# Altium project Controller.PrjPcb
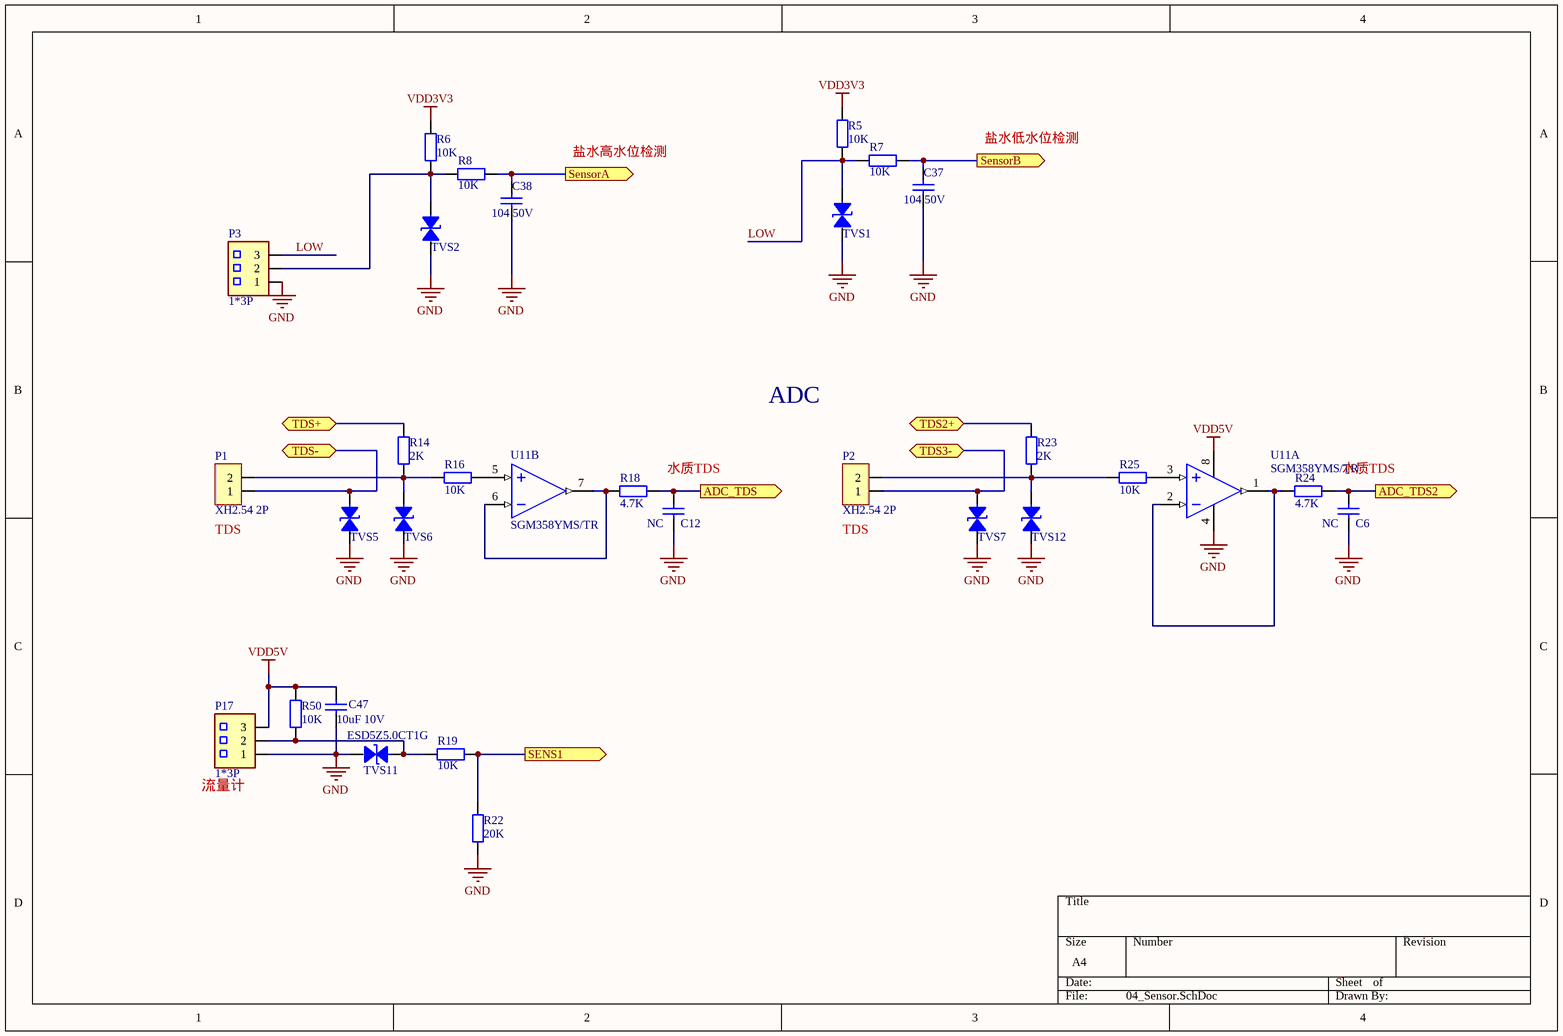
[diagram p0: 04_Sensor.SchDoc]
7 sheets, 201 parts. Net scope: global (net labels, ports and power ports of the same name join across sheets).
Board file: 电解模块主控板_V1.1_ZM_20211015.PcbDoc
Sheets:
  04_Sensor.SchDoc
  05_USART.SchDoc
  08_Peripherals.SchDoc
  13_SPI_Flash.SchDoc
  02_Power.SchDoc
  com.SchDoc
  07_EL_CON.SchDoc

## Sheet 04_Sensor.SchDoc
size A4

### Parts
C6  NC  [0603C]
C12  NC  [SMD-0603C]
C37  104 50V  [SMD-0603C]
C38  104 50V  [SMD-0603C]
C47  10uF 10V  [SMD-0603C]
P1  XH2.54 2P  [SIP-2A]
P2  XH2.54 2P  [SIP-2A]
P3  1*3P  [3X2MMZ]
P17  1*3P  [3X2.54MMZ2]
R5  10K  [SMD-0603]
R6  10K  [SMD-0603]
R7  10K  [SMD-0603]
R8  10K  [SMD-0603]
R14  2K  [SMD-0603]
R16  10K  [SMD-0603]
R18  4.7K  [SMD-0603]
R19  10K  [SMD-0603]
R22  20K  [SMD-0603]
R23  2K  [0603R]
R24  4.7K  [0603R]
R25  10K  [SMD-0603]
R50  10K  [SMD-0603]
TVS1  ESD5Z5.0CT1G  [SOD-523]  (value not drawn)
TVS2  ESD5Z5.0CT1G  [SOD-523]  (value not drawn)
TVS5  ESD5Z5.0CT1G  [SOD-523]  (value not drawn)
TVS6  ESD5Z5.0CT1G  [SOD-523]  (value not drawn)
TVS7  ESD5Z5.0CT1G  [SOD-523]  (value not drawn)
TVS11  ESD5Z5.0CT1G  [SOD-523]
TVS12  ESD5Z5.0CT1G  [SOD-523]  (value not drawn)
U11  SGM358YMS/TR  [MSOP-8]  (parts A,B of 2)

### Ports
ADC_TDS2 (out), ADC_TDS (out), SENS1 (out), SensorA (out), SensorB (out), TDS2+ (bidir), TDS3- (bidir), TDS+ (bidir), TDS- (bidir)

### Nets
GND: C6.1 C12.1 C37.1 C38.1 C47.1 P3.1 P17.1 R22.1 TVS1.1(A) TVS2.1(A) TVS5.1(A) TVS6.1(A) TVS7.1(A) TVS11.1(A) TVS12.1(A) U11.4(V-)
VDD3V3: R5.1 R6.1  [project net 3.3V]
VDD5V: C47.2 P17.3 R50.1 U11.8(V+)  [project net V5.0]
LOW: P3.3 R5.2 R7.1 TVS1.2(B)
NetC6_2: C6.2 R24.1 ; port ADC_TDS2
NetC12_2: C12.2 R18.1 ; port ADC_TDS
NetC37_2: C37.2 R7.2 ; port SensorB
NetC38_2: C38.2 R8.2 ; port SensorA
NetP1_1: P1.1 TVS5.2(B) ; port TDS-
NetP1_2: P1.2 R14.2 R16.1 TVS6.2(B)
NetP2_1: P2.1 TVS7.2(B) ; port TDS3-
NetP2_2: P2.2 R23.2 R25.1 TVS12.2(B)
NetP3_2: P3.2 R6.2 R8.1 TVS2.2(B)
NetP17_2: P17.2 R19.1 R50.2 TVS11.2(B)
NetR14_1: R14.1 ; port TDS+
NetR16_2: R16.2 U11.5(IN2+)
NetR18_2: R18.2 U11.6(IN2-) U11.7(OUT2)
NetR19_2: R19.2 R22.2 ; port SENS1
NetR23_1: R23.1 ; port TDS2+
NetR24_2: R24.2 U11.1(OUT1) U11.2(IN1-)
NetR25_2: R25.2 U11.3(IN1+)

### Notes on the sheet
- 盐水高水位检测
- 盐水低水位检测
- ADC
- 水质TDS
- (near P1) TDS
- (near P2) TDS
- (near P17) 流量计

### Library data of the parts
C6 C12 = CAP4: 贴片电容 10%
C37 C38 = CAP4: 贴片电容 20%
C47 = 0805 22uF (226) 20% 25V: 贴片电容 10%; value: 22uF 10V X5R; ComponentLink1Description: 供应商链接; ComponentLink1URL: http://www.szlcsc.com/product/details_46786.html; Package: 0805; Supplier: LC; SuppliersPartNumber: C45783
P1 P2 = SIP-2: XH2.54 2P 直插
P3 P17 = HDR1*3
R5-R8 R14 R16 R23 R25 = RES0: 贴片电阻 1%
R18 R24 = RES0: 贴片电阻 5%
R19 R22 R50 = 0603 10KΩ (1002) 1%: 贴片电阻 5%; ComponentLink1Description: 供应商链接; ComponentLink1URL: http://www.szlcsc.com/product/details_26547.html; Package: 0603; Supplier: LC; SuppliersPartNumber: C25804
TVS1 TVS2 TVS5-TVS7 TVS12 = TVS-1: TVS
TVS11 = TVS-1: TVS 5.0V
U11 = LM358: 运放

## Sheet 05_USART.SchDoc
size A4
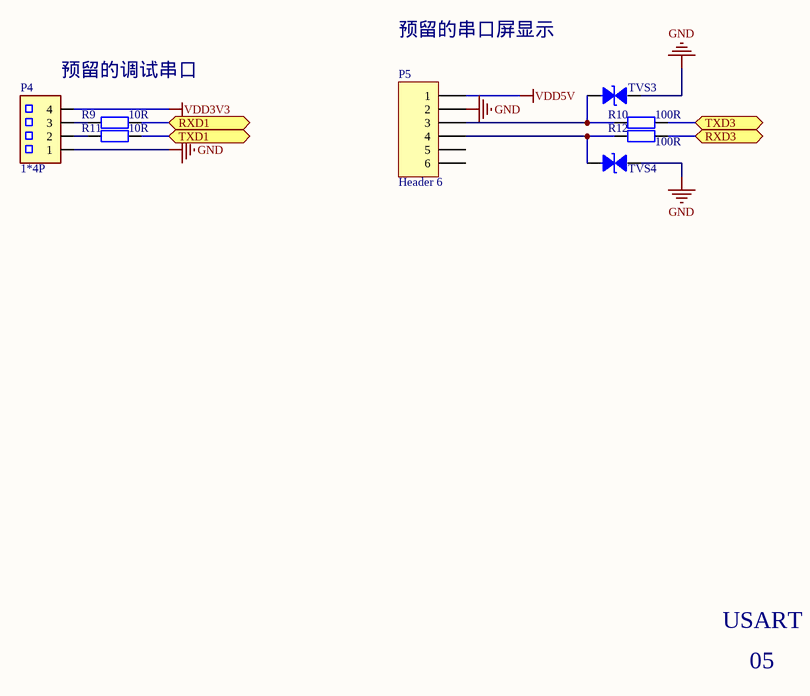
[diagram p1: 05_USART.SchDoc]

### Parts
P4  1*4P  [XH2.54-4A]
P5  Header 6  [6X2MMZ]
R9  10R  [SMD-0603]
R10  100R  [SMD-0603]
R11  10R  [SMD-0603]
R12  100R  [SMD-0603]
TVS3  ESD5Z5.0CT1G  [SOD-523]  (value not drawn)
TVS4  ESD5Z5.0CT1G  [SOD-523]  (value not drawn)

### Ports
RXD1 (bidir), RXD3 (bidir), TXD1 (bidir), TXD3 (bidir)

### Nets
GND: P4.1 P5.2 TVS3.1(A) TVS4.1(A)
VDD3V3: P4.4  [project net 3.3V]
VDD5V: P5.1  [project net V5.0]
NetP4_2: P4.2 R11.1
NetP4_3: P4.3 R9.1
NetP5_3: P5.3 R10.1 TVS3.2(B)
NetP5_4: P5.4 R12.1 TVS4.2(B)
NetR9_2: R9.2 ; port RXD1
NetR10_2: R10.2 ; port TXD3
NetR11_2: R11.2 ; port TXD1
NetR12_2: R12.2 ; port RXD3

Not connected (* = marked no-connect by the designer): P5 5 6

### Notes on the sheet
- 预留的调试串口
- 预留的串口屏显示
- USART
- 05

### Library data of the parts
P4 = HDR1*4
P5 = Header 6: Header, 6-Pin; LatestRevisionDate: 17-Jul-2002; LatestRevisionNote: Re-released for DXP Platform.; Publisher: Altium Limited
R9-R12 = RES2: 贴片电阻 5%
TVS3 TVS4 = TVS-1: TVS

## Sheet 08_Peripherals.SchDoc
size A4
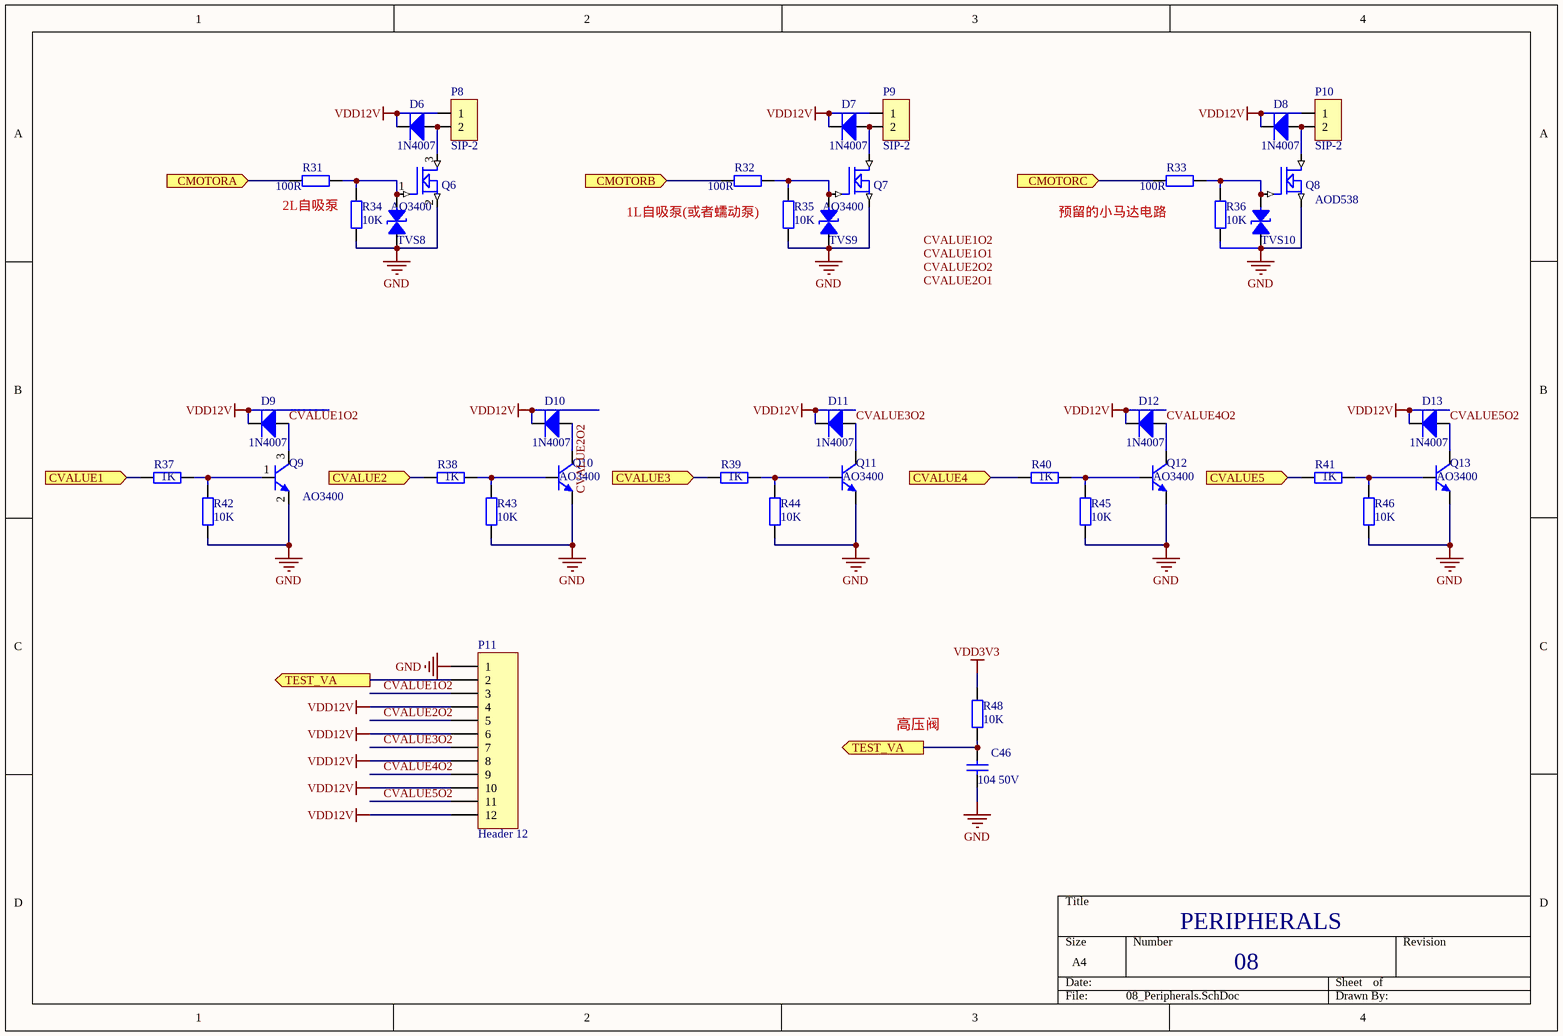
[diagram p2: 08_Peripherals.SchDoc]

### Parts
C46  104 50V  [SMD-0603C]
D6  1N4007  [DO-214-AC]
D7  1N4007  [DO-214-AC]
D8  1N4007  [DO-214-AC]
D9  1N4007  [DO-214-AC]
D10  1N4007  [DO-214-AC]
D11  1N4007  [DO-214-AC]
D12  1N4007  [DO-214-AC]
D13  1N4007  [DO-214-AC]
P8  SIP-2  [SIP-2A]
P9  SIP-2  [SIP-2A]
P10  SIP-2  [VH-AW-3.96*2P]
P11  Header 12  [12X2.54MMZ]
Q6  AO3400  [SOT-23]
Q7  AO3400  [SOT-23]
Q8  AOD538  [TO252]
Q9  AO3400  [SOT-23]
Q10  AO3400  [SOT-23]
Q11  AO3400  [SOT-23]
Q12  AO3400  [SOT-23]
Q13  AO3400  [SOT-23]
R31  100R  [SMD-0603]
R32  100R  [SMD-0603]
R33  100R  [SMD-0603]
R34  10K  [SMD-0603]
R35  10K  [SMD-0603]
R36  10K  [SMD-0603]
R37  1K  [SMD-0603]
R38  1K  [SMD-0603]
R39  1K  [SMD-0603]
R40  1K  [SMD-0603]
R41  1K  [SMD-0603]
R42  10K  [SMD-0603]
R43  10K  [SMD-0603]
R44  10K  [SMD-0603]
R45  10K  [SMD-0603]
R46  10K  [SMD-0603]
R48  10K  [SMD-0603]
TVS8  ESD5Z5.0CT1G  [SOD-523]  (value not drawn)
TVS9  ESD5Z5.0CT1G  [SOD-523]  (value not drawn)
TVS10  ESD5Z5.0CT1G  [SOD-523]  (value not drawn)

### Ports
CMOTORA (in), CMOTORB (in), CMOTORC (in), CVALUE1 (in), CVALUE2 (in), CVALUE3 (in), CVALUE4 (in), CVALUE5 (in), TEST_VA (out)

### Nets
GND: C46.1 P11.1 Q6.2(S) Q7.2(S) Q8.2(S) Q9.2(E) Q10.2(E) Q11.2(E) Q12.2(E) Q13.2(E) R34.2 R35.2 R36.2 R42.2 R43.2 R44.2 R45.2 R46.2 TVS8.1(A) TVS9.1(A) TVS10.1(A)
VDD3V3: R48.2  [project net 3.3V]
VDD12V: D6.2(K) D7.2(K) D8.2(K) D9.2(K) D10.2(K) D11.2(K) D12.2(K) D13.2(K) P8.1 P9.1 P10.1 P11.4 P11.6 P11.8 P11.10 P11.12
CVALUE1O2: D9.1(A) P11.3 Q9.3(C)
CVALUE2O2: D10.1(A) P11.5 Q10.3(C)
CVALUE3O2: D11.1(A) P11.7 Q11.3(C)
CVALUE4O2: D12.1(A) P11.9 Q12.3(C)
CVALUE5O2: D13.1(A) P11.11 Q13.3(C)
NetC46_2: C46.2 P11.2 R48.1 ; port TEST_VA
NetD6_1: D6.1(A) P8.2 Q6.3(D)
NetD7_1: D7.1(A) P9.2 Q7.3(D)
NetD8_1: D8.1(A) P10.2 Q8.3(D)
NetQ6_1: Q6.1(G) R31.1 R34.1 TVS8.2(B)
NetQ7_1: Q7.1(G) R32.1 R35.1 TVS9.2(B)
NetQ8_1: Q8.1(G) R33.1 R36.1 TVS10.2(B)
NetQ9_1: Q9.1(B) R37.1 R42.1
NetQ10_1: Q10.1(B) R38.1 R43.1
NetQ11_1: Q11.1(B) R39.1 R44.1
NetQ12_1: Q12.1(B) R40.1 R45.1
NetQ13_1: Q13.1(B) R41.1 R46.1
NetR31_2: R31.2 ; port CMOTORA
NetR32_2: R32.2 ; port CMOTORB
NetR33_2: R33.2 ; port CMOTORC
NetR37_2: R37.2 ; port CVALUE1
NetR38_2: R38.2 ; port CVALUE2
NetR39_2: R39.2 ; port CVALUE3
NetR40_2: R40.2 ; port CVALUE4
NetR41_2: R41.2 ; port CVALUE5

### Notes on the sheet
- (near R31) 2L自吸泵
- (near R32) 1L自吸泵(或者蠕动泵)
- 预留的小马达电路
- 高压阀
- PERIPHERALS
- 08
- Labels drawn without touching a wire or pin: CVALUE1O1, CVALUE1O2, CVALUE2O1, CVALUE2O2

### Library data of the parts
C46 = CAP4: 贴片电容 10%
D6-D13 = DIODE2: 贴片二极管
P8-P10 = SIP-2: XH2.54 2P 立贴
P11 = Header 12: Header, 12-Pin; LatestRevisionDate: 17-Jul-2002; LatestRevisionNote: Re-released for DXP Platform.; Publisher: Altium Limited
Q6-Q8 = MOSFET N
Q9-Q13 = NPN-1: 三极管
R31-R46 R48 = RES-SOP: 贴片电阻 5%
TVS8-TVS10 = TVS-1: TVS

## Sheet 13_SPI_Flash.SchDoc
size A4
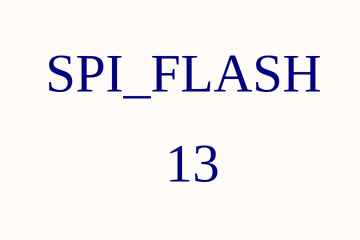
[diagram p3: 13_SPI_Flash.SchDoc]

### Notes on the sheet
- SPI_FLASH
- 13

## Sheet 02_Power.SchDoc
size A4
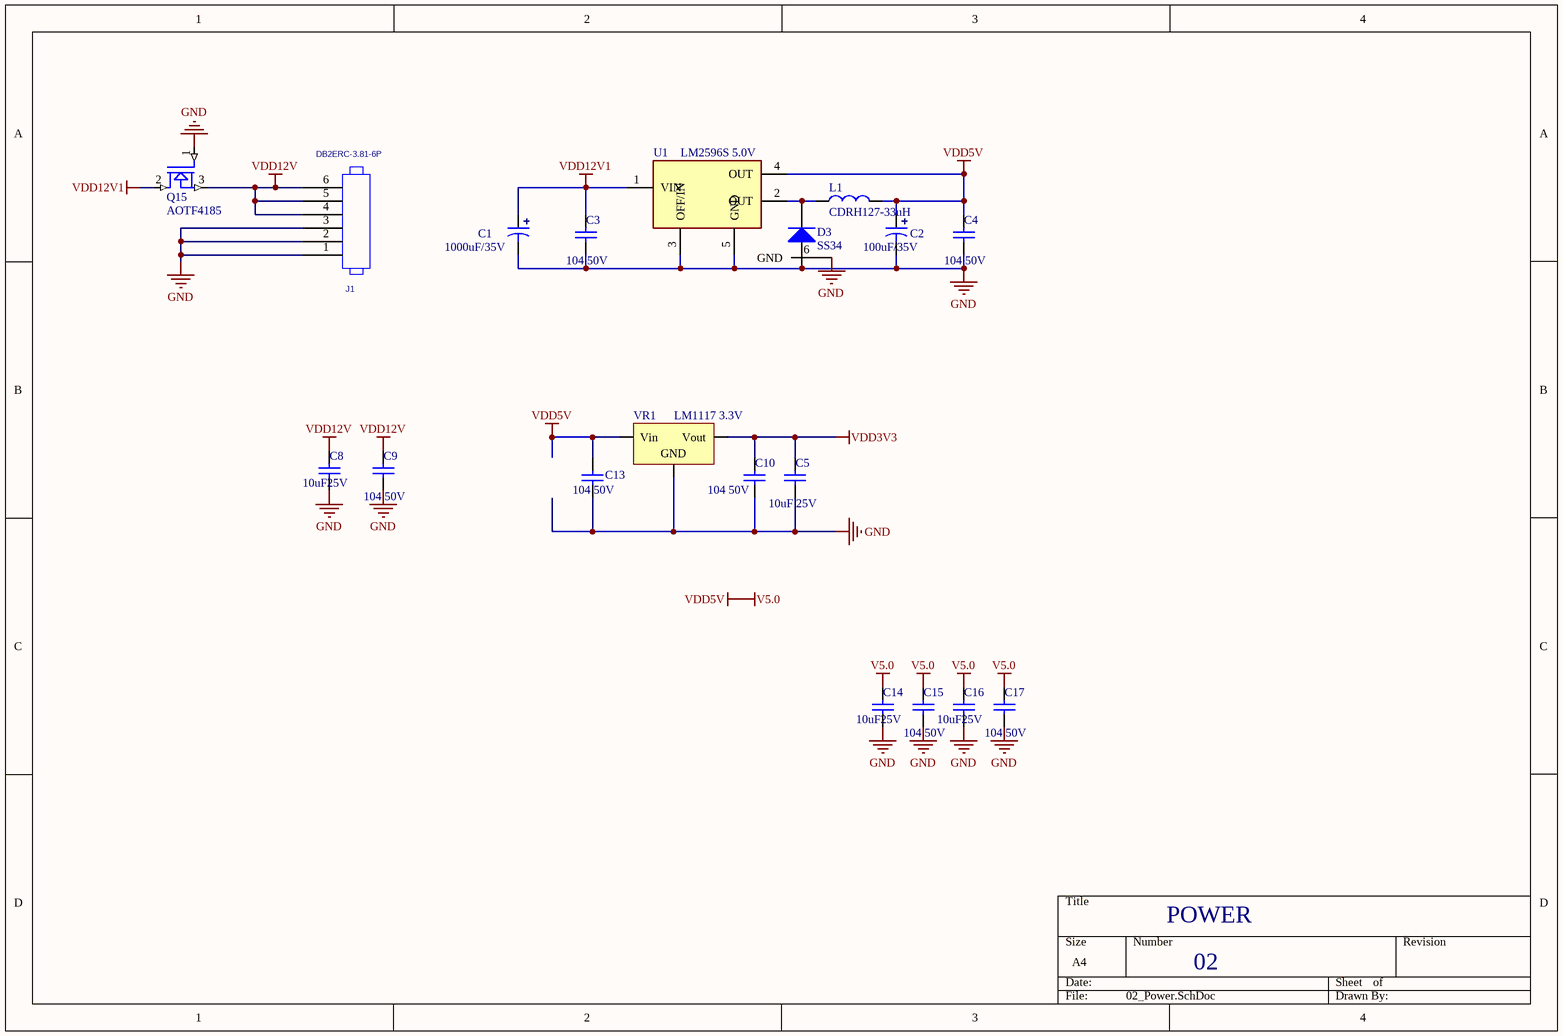
[diagram p4: 02_Power.SchDoc]

### Parts
C1  1000uF/35V  [10*16]
C2  100uF/35V  [6*8]
C3  104 50V  [SMD-0805C]
C4  104 50V  [SMD-0805C]
C5  10uF 25V  [SMD-0603C]
C8  10uF25V  [SMD-0603C]
C9  104 50V  [SMD-0603C]
C10  104 50V  [SMD-0603C]
C13  104 50V  [SMD-0603C]
C14  10uF25V  [SMD-0603C]
C15  104 50V  [SMD-0603C]
C16  10uF25V  [SMD-0603C]
C17  104 50V  [SMD-0603C]
D3  SS34  [SMA]
J1  value DB2ERC-3.81-6P  [VH-AW-3.96*6P]  (hidden comment: HEADER_6)
L1  CDRH127-33uH  [CDRH-127]
Q15  AOTF4185  [to220]
U1  LM2596S 5.0V  [TO-263-5]
VR1  LM1117 3.3V  [SOT223]

### Nets
GND: C1.2 C2.2 C3.1 C4.1 C5.1 C8.1 C9.1 C10.1 C13.1 C14.1 C15.1 C16.1 C17.1 D3.1(A) J1.1 J1.2 J1.3 Q15.1(G) U1.3(OFF/IN) U1.5(GND) U1.6(GND) VR1.1(GND)
V5.0: C2.1 C4.2 C13.2 C14.2 C15.2 C16.2 C17.2 L1.2 U1.4(OUT) VR1.3(Vin)  [also labelled VDD5V]
VDD3V3: C5.2 C10.2 VR1.2(Vout)  [project net 3.3V]
VDD12V: C8.2 C9.2 J1.4 J1.5 J1.6 Q15.3(S)
VDD12V1: C1.1 C3.2 Q15.2(D) U1.1(VIN)
NetD3_2: D3.2(K) L1.1 U1.2(OUT)

### Notes on the sheet
- POWER
- 02

### Library data of the parts
C1 C2 = CAP2: 电解电容
C3 C4 C8-C10 C13 = CAP4: 贴片电容 10%
C5 C14-C17 = CAP4: 贴片电容 20%
D3 = DIODE
J1 = HEADER_6: PCB DECAL: DB2ERC-3P81-6P; Source_Path: C:\MYPROGRAM\CADENCE\SPB_16.6\TOOLS\CAPTURE\LIBRARY\CONNECTOR.OLB
L1 = IND
Q15 = MOSFET N
U1 = LM2596
VR1 = LM1117: 三端稳压器

## Sheet com.SchDoc
size A4
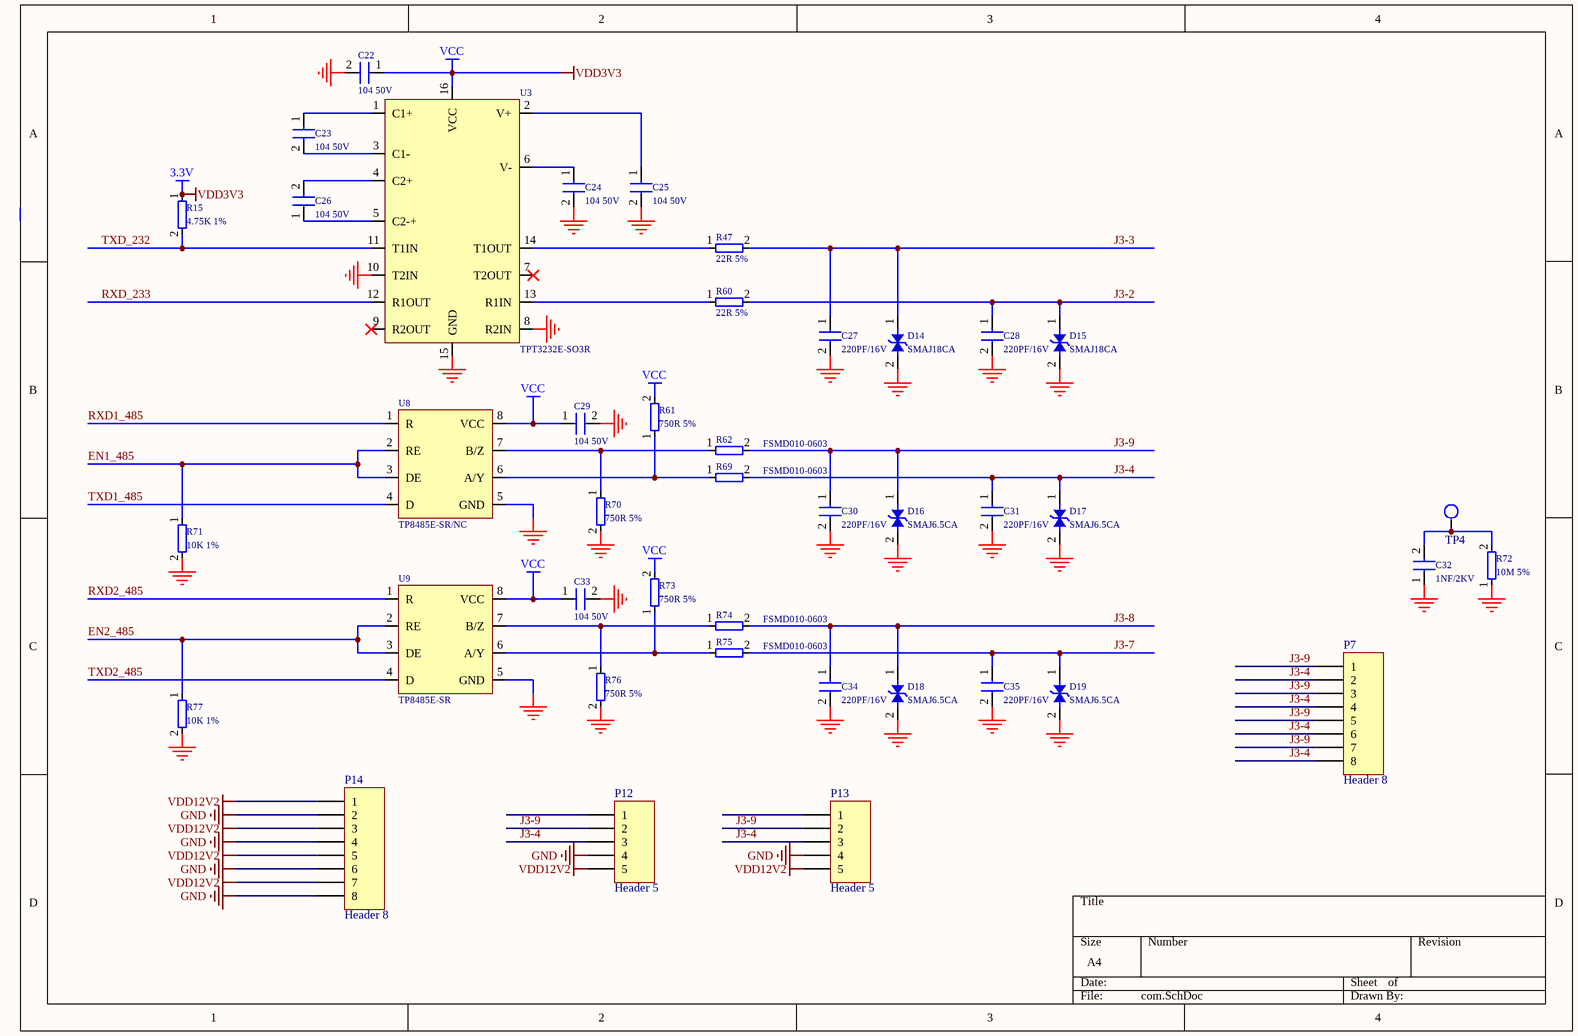
[diagram p5: com.SchDoc]

### Parts
C22  104 50V  [0603C]
C23  104 50V  [0603C]
C24  104 50V  [0603C]
C25  104 50V  [0603C]
C26  104 50V  [0603C]
C27  220PF/16V  [0603C]
C28  220PF/16V  [0603C]
C29  104 50V  [0603C]
C30  220PF/16V  [0603C]
C31  220PF/16V  [0603C]
C32  1NF/2KV  [1206C]
C33  104 50V  [0603C]
C34  220PF/16V  [0603C]
C35  220PF/16V  [0603C]
D14  SMAJ18CA  [SMA]
D15  SMAJ18CA  [SMA]
D16  SMAJ6.5CA  [SMA]
D17  SMAJ6.5CA  [SMA]
D18  SMAJ6.5CA  [SMA]
D19  SMAJ6.5CA  [SMA]
P7  Header 8  [8X2.54MMZ]
P12  Header 5  [5X2.54MMZ]
P13  Header 5  [5X2.54MMZ]
P14  Header 8  [8X2.54MMZ]
R15  4.75K 1%  [0603R]
R47  22R 5%  [0603R]
R60  22R 5%  [0603R]
R61  750R 5%  [0603R]
R62  FSMD010-0603  [0603R]
R69  FSMD010-0603  [0603R]
R70  750R 5%  [0603R]
R71  10K 1%  [0603R]
R72  10M 5%  [1206r]
R73  750R 5%  [0603R]
R74  FSMD010-0603  [0603R]
R75  FSMD010-0603  [0603R]
R76  750R 5%  [0603R]
R77  10K 1%  [0603R]
TP4  TPS  [tpd]  (value not drawn)
U3  TPT3232E-SO3R  [SO-16Z]
U8  TP8485E-SR/NC  [SO-8]
U9  TP8485E-SR  [SO-8]

### Nets
3.3V: C22.1 C29.1 C33.1 R15.1 R61.2 R73.2 U3.16(VCC) U8.8(VCC) U9.8(VCC)  [also labelled VCC, VDD3V3]
GND: C22.2 C24.2 C25.2 C27.2 C28.2 C29.2 C30.2 C31.2 C32.1 C33.2 C34.2 C35.2 D14.2 D15.2 D16.2 D17.2 D18.2 D19.2 P12.4 P13.4 P14.2 P14.4 P14.6 P14.8 R70.2 R71.2 R72.1 R76.2 R77.2 U3.8(R2IN) U3.10(T2IN) U3.15(GND) U8.5(GND) U9.5(GND)
VDD12V2: P12.5 P13.5 P14.1 P14.3 P14.5 P14.7
EN1_485: R71.1 U8.2(RE) U8.3(DE)
EN2_485: R77.1 U9.2(RE) U9.3(DE)
J3-2: C28.1 D15.1 R60.2
J3-3: C27.1 D14.1 R47.2
J3-4: C31.1 D17.1 P7.2 P7.4 P7.6 P7.8 P12.3 P13.3 R69.2
J3-7: C35.1 D19.1 R75.2
J3-8: C34.1 D18.1 R74.2
J3-9: C30.1 D16.1 P7.1 P7.3 P7.5 P7.7 P12.2 P13.2 R62.2
RXD1_485: U8.1(R)
RXD2_485: U9.1(R)
RXD_233: U3.12(R1OUT)
TXD1_485: U8.4(D)
TXD2_485: U9.4(D)
TXD_232: R15.2 U3.11(T1IN)
NetC23_1: C23.1 U3.1(C1+)
NetC23_2: C23.2 U3.3(C1-)
NetC24_1: C24.1 U3.6(V-)
NetC25_1: C25.1 U3.2(V+)
NetC26_1: C26.1 U3.5(C2-+)
NetC26_2: C26.2 U3.4(C2+)
NetC32_2: C32.2 R72.2 TP4.1
NetR47_1: R47.1 U3.14(T1OUT)
NetR60_1: R60.1 U3.13(R1IN)
NetR61_1: R61.1 R69.1 U8.6(A/Y)
NetR62_1: R62.1 R70.1 U8.7(B/Z)
NetR73_1: R73.1 R75.1 U9.6(A/Y)
NetR74_1: R74.1 R76.1 U9.7(B/Z)

Not connected (* = marked no-connect by the designer): P12 1; P13 1; U3 7(T2OUT)* 9(R2OUT)*

### Library data of the parts
C22-C35 = CAP
D14-D19 = D_ESD
P7 P14 = Header 8: Header, 8-Pin; LatestRevisionDate: 17-Jul-2002; LatestRevisionNote: Re-released for DXP Platform.; Publisher: Altium Limited
P12 P13 = Header 5: Header, 5-Pin; LatestRevisionDate: 17-Jul-2002; LatestRevisionNote: Re-released for DXP Platform.; Publisher: Altium Limited
R15 R47 R60-R62 R69-R77 = RES
U8 = TP8485E-SR

## Sheet 07_EL_CON.SchDoc
size A2
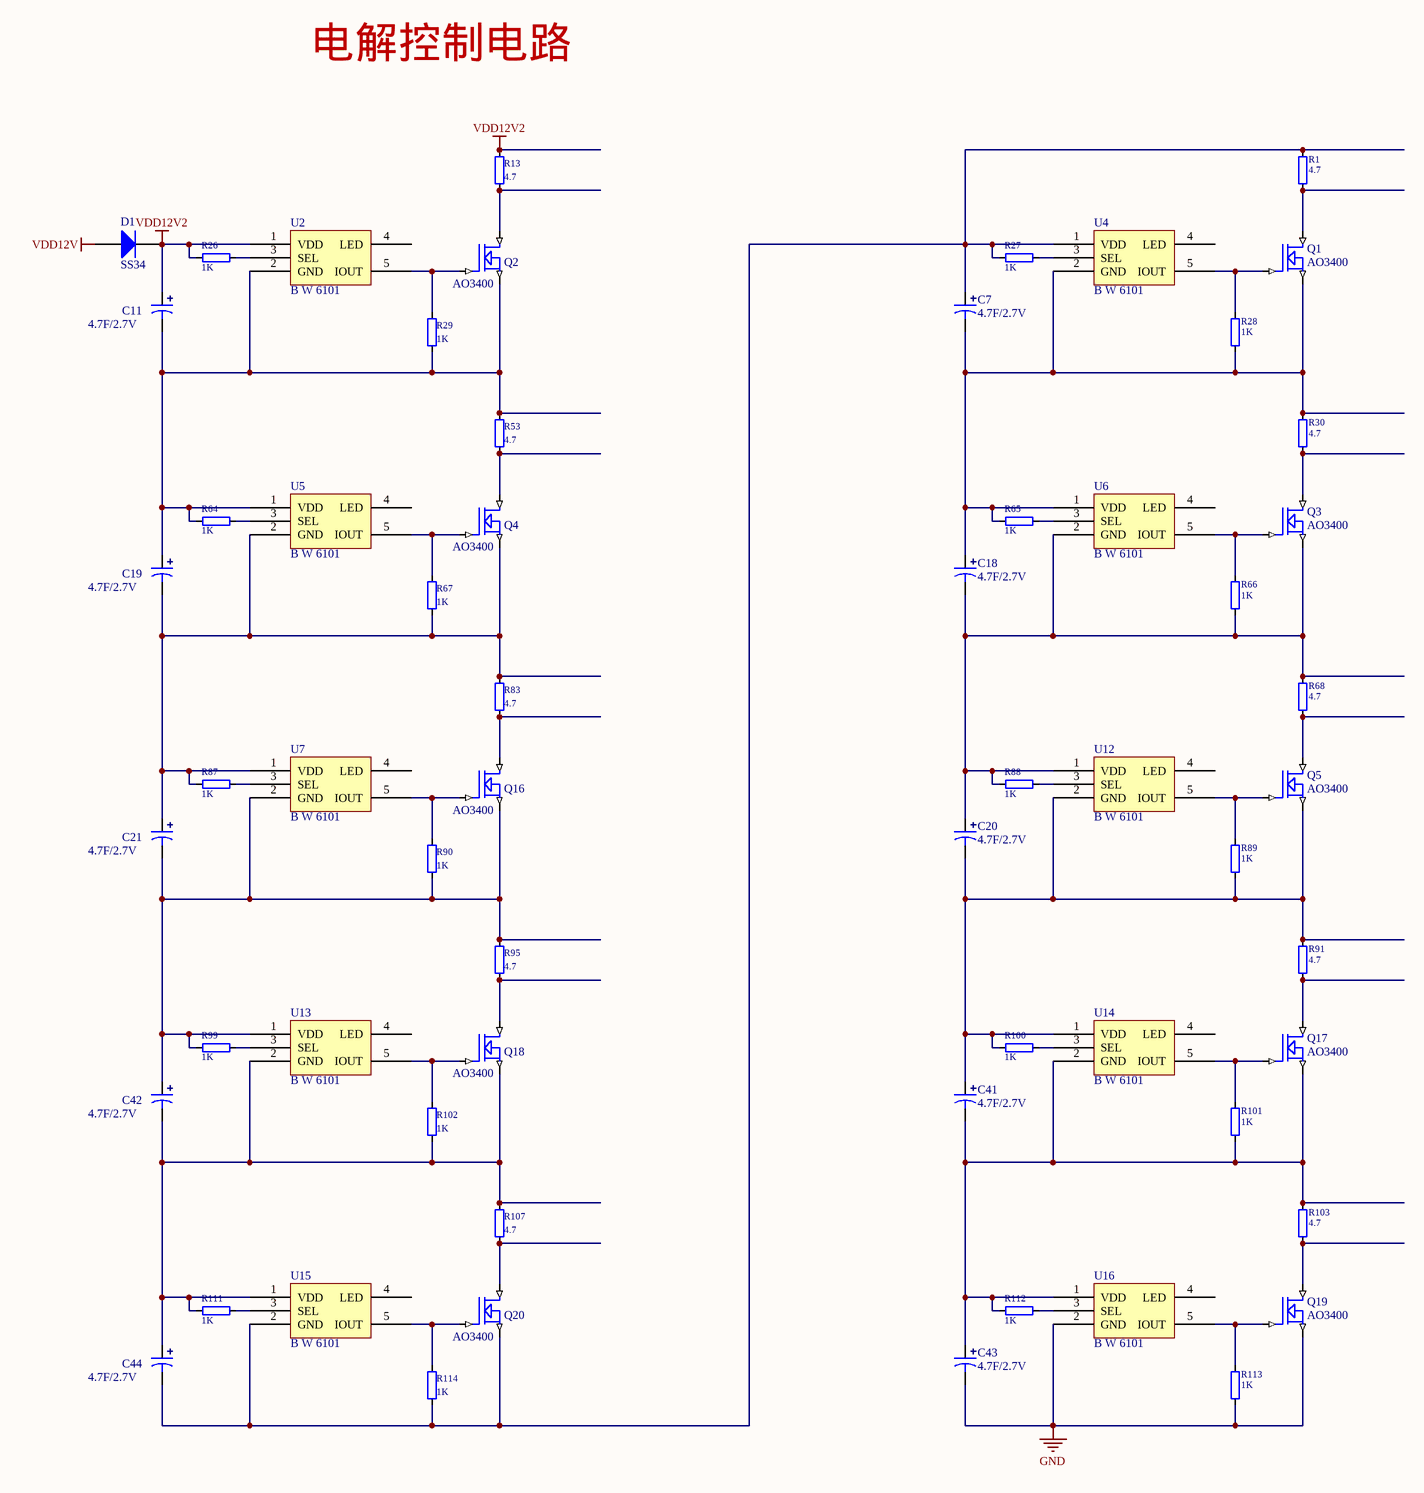
[diagram p6: 07_EL_CON.SchDoc]

### Parts
C7  4.7F/2.7V  [10*16 -5]
C11  4.7F/2.7V  [10*16 -5]
C18  4.7F/2.7V  [10*16 -5]
C19  4.7F/2.7V  [10*16 -5]
C20  4.7F/2.7V  [10*16 -5]
C21  4.7F/2.7V  [10*16 -5]
C41  4.7F/2.7V  [10*16 -5]
C42  4.7F/2.7V  [10*16 -5]
C43  4.7F/2.7V  [10*16 -5]
C44  4.7F/2.7V  [10*16 -5]
D1  SS34  [SMA]
Q1  AO3400  [SOT-23]
Q2  AO3400  [SOT-23]
Q3  AO3400  [SOT-23]
Q4  AO3400  [SOT-23]
Q5  AO3400  [SOT-23]
Q16  AO3400  [SOT-23]
Q17  AO3400  [SOT-23]
Q18  AO3400  [SOT-23]
Q19  AO3400  [SOT-23]
Q20  AO3400  [SOT-23]
R1  4.7  [2010R]
R13  4.7  [2010R]
R26  1K  [0603R]
R27  1K  [0603R]
R28  1K  [0603R]
R29  1K  [0603R]
R30  4.7  [2010R]
R53  4.7  [2010R]
R64  1K  [0603R]
R65  1K  [0603R]
R66  1K  [0603R]
R67  1K  [0603R]
R68  4.7  [2010R]
R83  4.7  [2010R]
R87  1K  [0603R]
R88  1K  [0603R]
R89  1K  [0603R]
R90  1K  [0603R]
R91  4.7  [2010R]
R95  4.7  [2010R]
R99  1K  [0603R]
R100  1K  [0603R]
R101  1K  [0603R]
R102  1K  [0603R]
R103  4.7  [2010R]
R107  4.7  [2010R]
R111  1K  [0603R]
R112  1K  [0603R]
R113  1K  [0603R]
R114  1K  [0603R]
U2  B W 6101  [SOT23-5]
U4  B W 6101  [SOT23-5]
U5  B W 6101  [SOT23-5]
U6  B W 6101  [SOT23-5]
U7  B W 6101  [SOT23-5]
U12  B W 6101  [SOT23-5]
U13  B W 6101  [SOT23-5]
U14  B W 6101  [SOT23-5]
U15  B W 6101  [SOT23-5]
U16  B W 6101  [SOT23-5]

### Nets
GND: C43.2 Q19.2(S) R113.2 U16.2(GND)
VDD12V: D1.1(A)
VDD12V2: C11.1 D1.2(K) R13.1 R26.1 U2.1(VDD)
NetC7_1: C7.1 C44.2 Q20.2(S) R1.1 R27.1 R114.2 U4.1(VDD) U15.2(GND)
NetC7_2: C7.2 C18.1 Q1.2(S) R28.2 R30.1 R65.1 U4.2(GND) U6.1(VDD)
NetC11_2: C11.2 C19.1 Q2.2(S) R29.2 R53.1 R64.1 U2.2(GND) U5.1(VDD)
NetC18_2: C18.2 C20.1 Q3.2(S) R66.2 R68.1 R88.1 U6.2(GND) U12.1(VDD)
NetC19_2: C19.2 C21.1 Q4.2(S) R67.2 R83.1 R87.1 U5.2(GND) U7.1(VDD)
NetC20_2: C20.2 C41.1 Q5.2(S) R89.2 R91.1 R100.1 U12.2(GND) U14.1(VDD)
NetC21_2: C21.2 C42.1 Q16.2(S) R90.2 R95.1 R99.1 U7.2(GND) U13.1(VDD)
NetC41_2: C41.2 C43.1 Q17.2(S) R101.2 R103.1 R112.1 U14.2(GND) U16.1(VDD)
NetC42_2: C42.2 C44.1 Q18.2(S) R102.2 R107.1 R111.1 U13.2(GND) U15.1(VDD)
NetQ1_1: Q1.1(G) R28.1 U4.5(IOUT)
NetQ1_3: Q1.3(D) R1.2
NetQ2_1: Q2.1(G) R29.1 U2.5(IOUT)
NetQ2_3: Q2.3(D) R13.2
NetQ3_1: Q3.1(G) R66.1 U6.5(IOUT)
NetQ3_3: Q3.3(D) R30.2
NetQ4_1: Q4.1(G) R67.1 U5.5(IOUT)
NetQ4_3: Q4.3(D) R53.2
NetQ5_1: Q5.1(G) R89.1 U12.5(IOUT)
NetQ5_3: Q5.3(D) R68.2
NetQ16_1: Q16.1(G) R90.1 U7.5(IOUT)
NetQ16_3: Q16.3(D) R83.2
NetQ17_1: Q17.1(G) R101.1 U14.5(IOUT)
NetQ17_3: Q17.3(D) R91.2
NetQ18_1: Q18.1(G) R102.1 U13.5(IOUT)
NetQ18_3: Q18.3(D) R95.2
NetQ19_1: Q19.1(G) R113.1 U16.5(IOUT)
NetQ19_3: Q19.3(D) R103.2
NetQ20_1: Q20.1(G) R114.1 U15.5(IOUT)
NetQ20_3: Q20.3(D) R107.2
NetR26_2: R26.2 U2.3(SEL)
NetR27_2: R27.2 U4.3(SEL)
NetR64_2: R64.2 U5.3(SEL)
NetR65_2: R65.2 U6.3(SEL)
NetR87_2: R87.2 U7.3(SEL)
NetR88_2: R88.2 U12.3(SEL)
NetR99_2: R99.2 U13.3(SEL)
NetR100_2: R100.2 U14.3(SEL)
NetR111_2: R111.2 U15.3(SEL)
NetR112_2: R112.2 U16.3(SEL)

Not connected (* = marked no-connect by the designer): U2 4(LED); U4 4(LED); U5 4(LED); U6 4(LED); U7 4(LED); U12 4(LED); U13 4(LED); U14 4(LED); U15 4(LED); U16 4(LED)

### Notes on the sheet
- 电解控制电路

### Library data of the parts
C7 C11 C18-C21 C41-C44 = CAP2: 电解电容
D1 = DIODE
Q1-Q5 Q16-Q20 = MOSFET N
R1 R13 R26-R30 R53 R64-R68 R83 R87-R91 R95 R99-R103 R107 R111-R114 = RES

## Nets that join several sheets
3.3V: 04_Sensor (R5.1 R6.1), 05_USART (P4.4), 08_Peripherals (R48.2), 02_Power (C5.2 C10.2 VR1.2), com (9 pins)
GND: 04_Sensor (16 pins), 05_USART (P4.1 P5.2 TVS3.1 TVS4.1), 08_Peripherals (21 pins), 02_Power (22 pins), com (34 pins), 07_EL_CON (C43.2 Q19.2 R113.2 U16.2)
V5.0: 04_Sensor (C47.2 P17.3 R50.1 U11.8), 05_USART (P5.1), 02_Power (10 pins)
VDD12V: 08_Peripherals (16 pins), 02_Power (6 pins), 07_EL_CON (D1.1)
VDD12V2: com (6 pins), 07_EL_CON (5 pins)